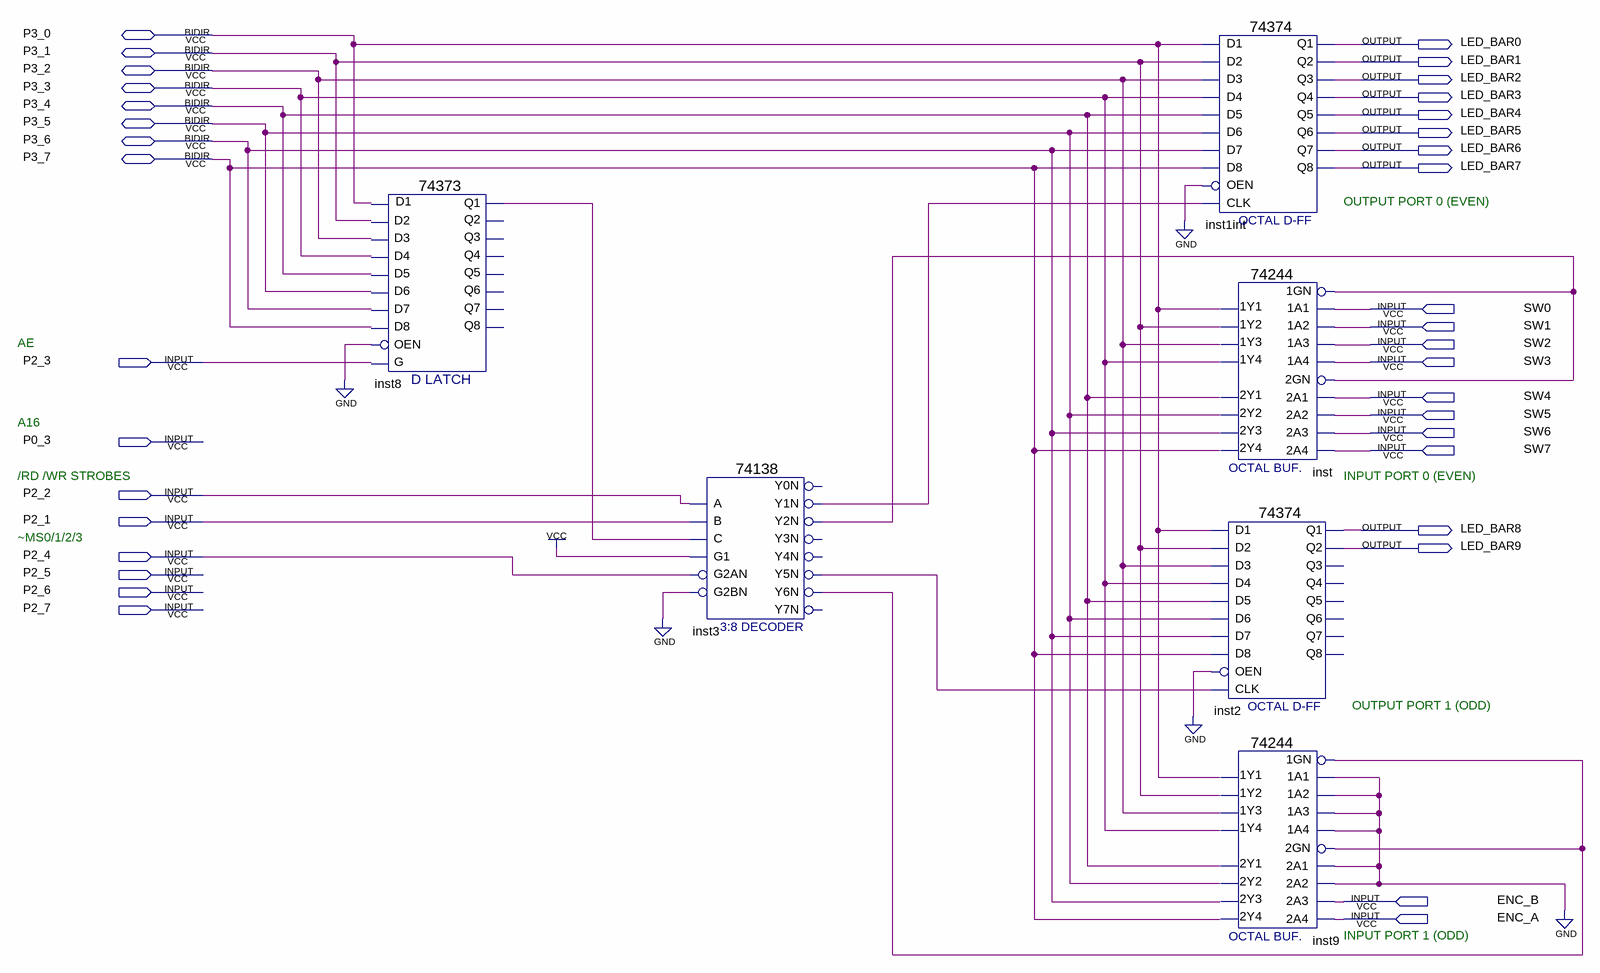
[diagram p0: schematic sheet]
// Quartus schematic ece315_top.bdf as structural Verilog: 6 symbols, 36 pins
module ece315_top (
  input  SW0,
  input  SW1,
  input  SW2,
  input  P2_3,
  input  SW3,
  input  SW4,
  input  SW5,
  input  SW6,
  input  P0_3,
  input  SW7,
  input  P2_2,
  input  P2_1,
  input  P2_4,
  input  P2_5,
  input  P2_6,
  input  P2_7,
  input  ENC_B,
  input  ENC_A,
  inout  P3_0,
  inout  P3_1,
  inout  P3_2,
  inout  P3_3,
  inout  P3_4,
  inout  P3_5,
  inout  P3_6,
  inout  P3_7,
  output LED_BAR0,
  output LED_BAR1,
  output LED_BAR2,
  output LED_BAR3,
  output LED_BAR4,
  output LED_BAR5,
  output LED_BAR6,
  output LED_BAR7,
  output LED_BAR8,
  output LED_BAR9
);

  wire inst3_y1n, inst3_y2n, inst3_y5n, inst3_y6n, inst8_q1;

  \74373  inst8 (
    .D1(P3_0), .D3(P3_2), .D6(P3_5), .D7(P3_6), .D2(P3_1), .G(P2_3), .D4(P3_3), .D5(P3_4), .D8(P3_7),
    .OEN(1'b0), .Q1(inst8_q1));  // open: Q3, Q6, Q7, Q2, Q8, Q4, Q5
  \74138  inst3 (
    .A(P2_2), .B(P2_1), .G1(1'b1), .C(inst8_q1), .G2AN(P2_4), .G2BN(1'b0), .Y1N(inst3_y1n), .Y2N(inst3_y2n),
    .Y5N(inst3_y5n), .Y6N(inst3_y6n));  // open: Y0N, Y3N, Y4N, Y7N
  \74374  inst1int (
    .D1(P3_0), .D2(P3_1), .D3(P3_2), .D4(P3_3), .D6(P3_5), .D5(P3_4), .OEN(1'b0), .D8(P3_7), .D7(P3_6),
    .CLK(inst3_y1n), .Q2(LED_BAR1), .Q3(LED_BAR2), .Q5(LED_BAR4), .Q4(LED_BAR3), .Q6(LED_BAR5),
    .Q7(LED_BAR6), .Q8(LED_BAR7), .Q1(LED_BAR0));
  \74244  inst (
    .\1A2 (SW1), .\1A4 (SW3), .\1A1 (SW0), .\1A3 (SW2), .\1GN (inst3_y2n), .\2A3 (SW6), .\2GN (inst3_y2n),
    .\2A1 (SW4), .\2A4 (SW7), .\2A2 (SW5), .\1Y2 (P3_1), .\1Y4 (P3_3), .\2Y1 (P3_4), .\1Y1 (P3_0),
    .\2Y3 (P3_6), .\2Y4 (P3_7), .\1Y3 (P3_2), .\2Y2 (P3_5));
  \74374  inst2 (
    .D1(P3_0), .D2(P3_1), .D3(P3_2), .D4(P3_3), .D6(P3_5), .D5(P3_4), .OEN(1'b0), .D8(P3_7), .D7(P3_6),
    .CLK(inst3_y5n), .Q2(LED_BAR9), .Q1(LED_BAR8));  // open: Q3, Q5, Q4, Q6, Q7, Q8
  \74244  inst9 (
    .\1A2 (1'b0), .\1A4 (1'b0), .\1A1 (1'b0), .\1A3 (1'b0), .\1GN (inst3_y6n), .\2A3 (ENC_B),
    .\2GN (inst3_y6n), .\2A1 (1'b0), .\2A4 (ENC_A), .\2A2 (1'b0), .\1Y2 (P3_1), .\1Y4 (P3_3), .\2Y1 (P3_4),
    .\1Y1 (P3_0), .\2Y3 (P3_6), .\2Y4 (P3_7), .\1Y3 (P3_2), .\2Y2 (P3_5));

  // Notes on the sheet:
  //   OUTPUT PORT 0 (EVEN)
  //   AE
  //   A16
  //   /RD /WR STROBES
  //   INPUT PORT 0 (EVEN)
  //   ~MS0/1/2/3
  //   OUTPUT PORT 1 (ODD)
  //   INPUT PORT 1 (ODD)
endmodule
